# EAGLE design comms_sys_schematic_R2 (EAGLE 9.5.2)
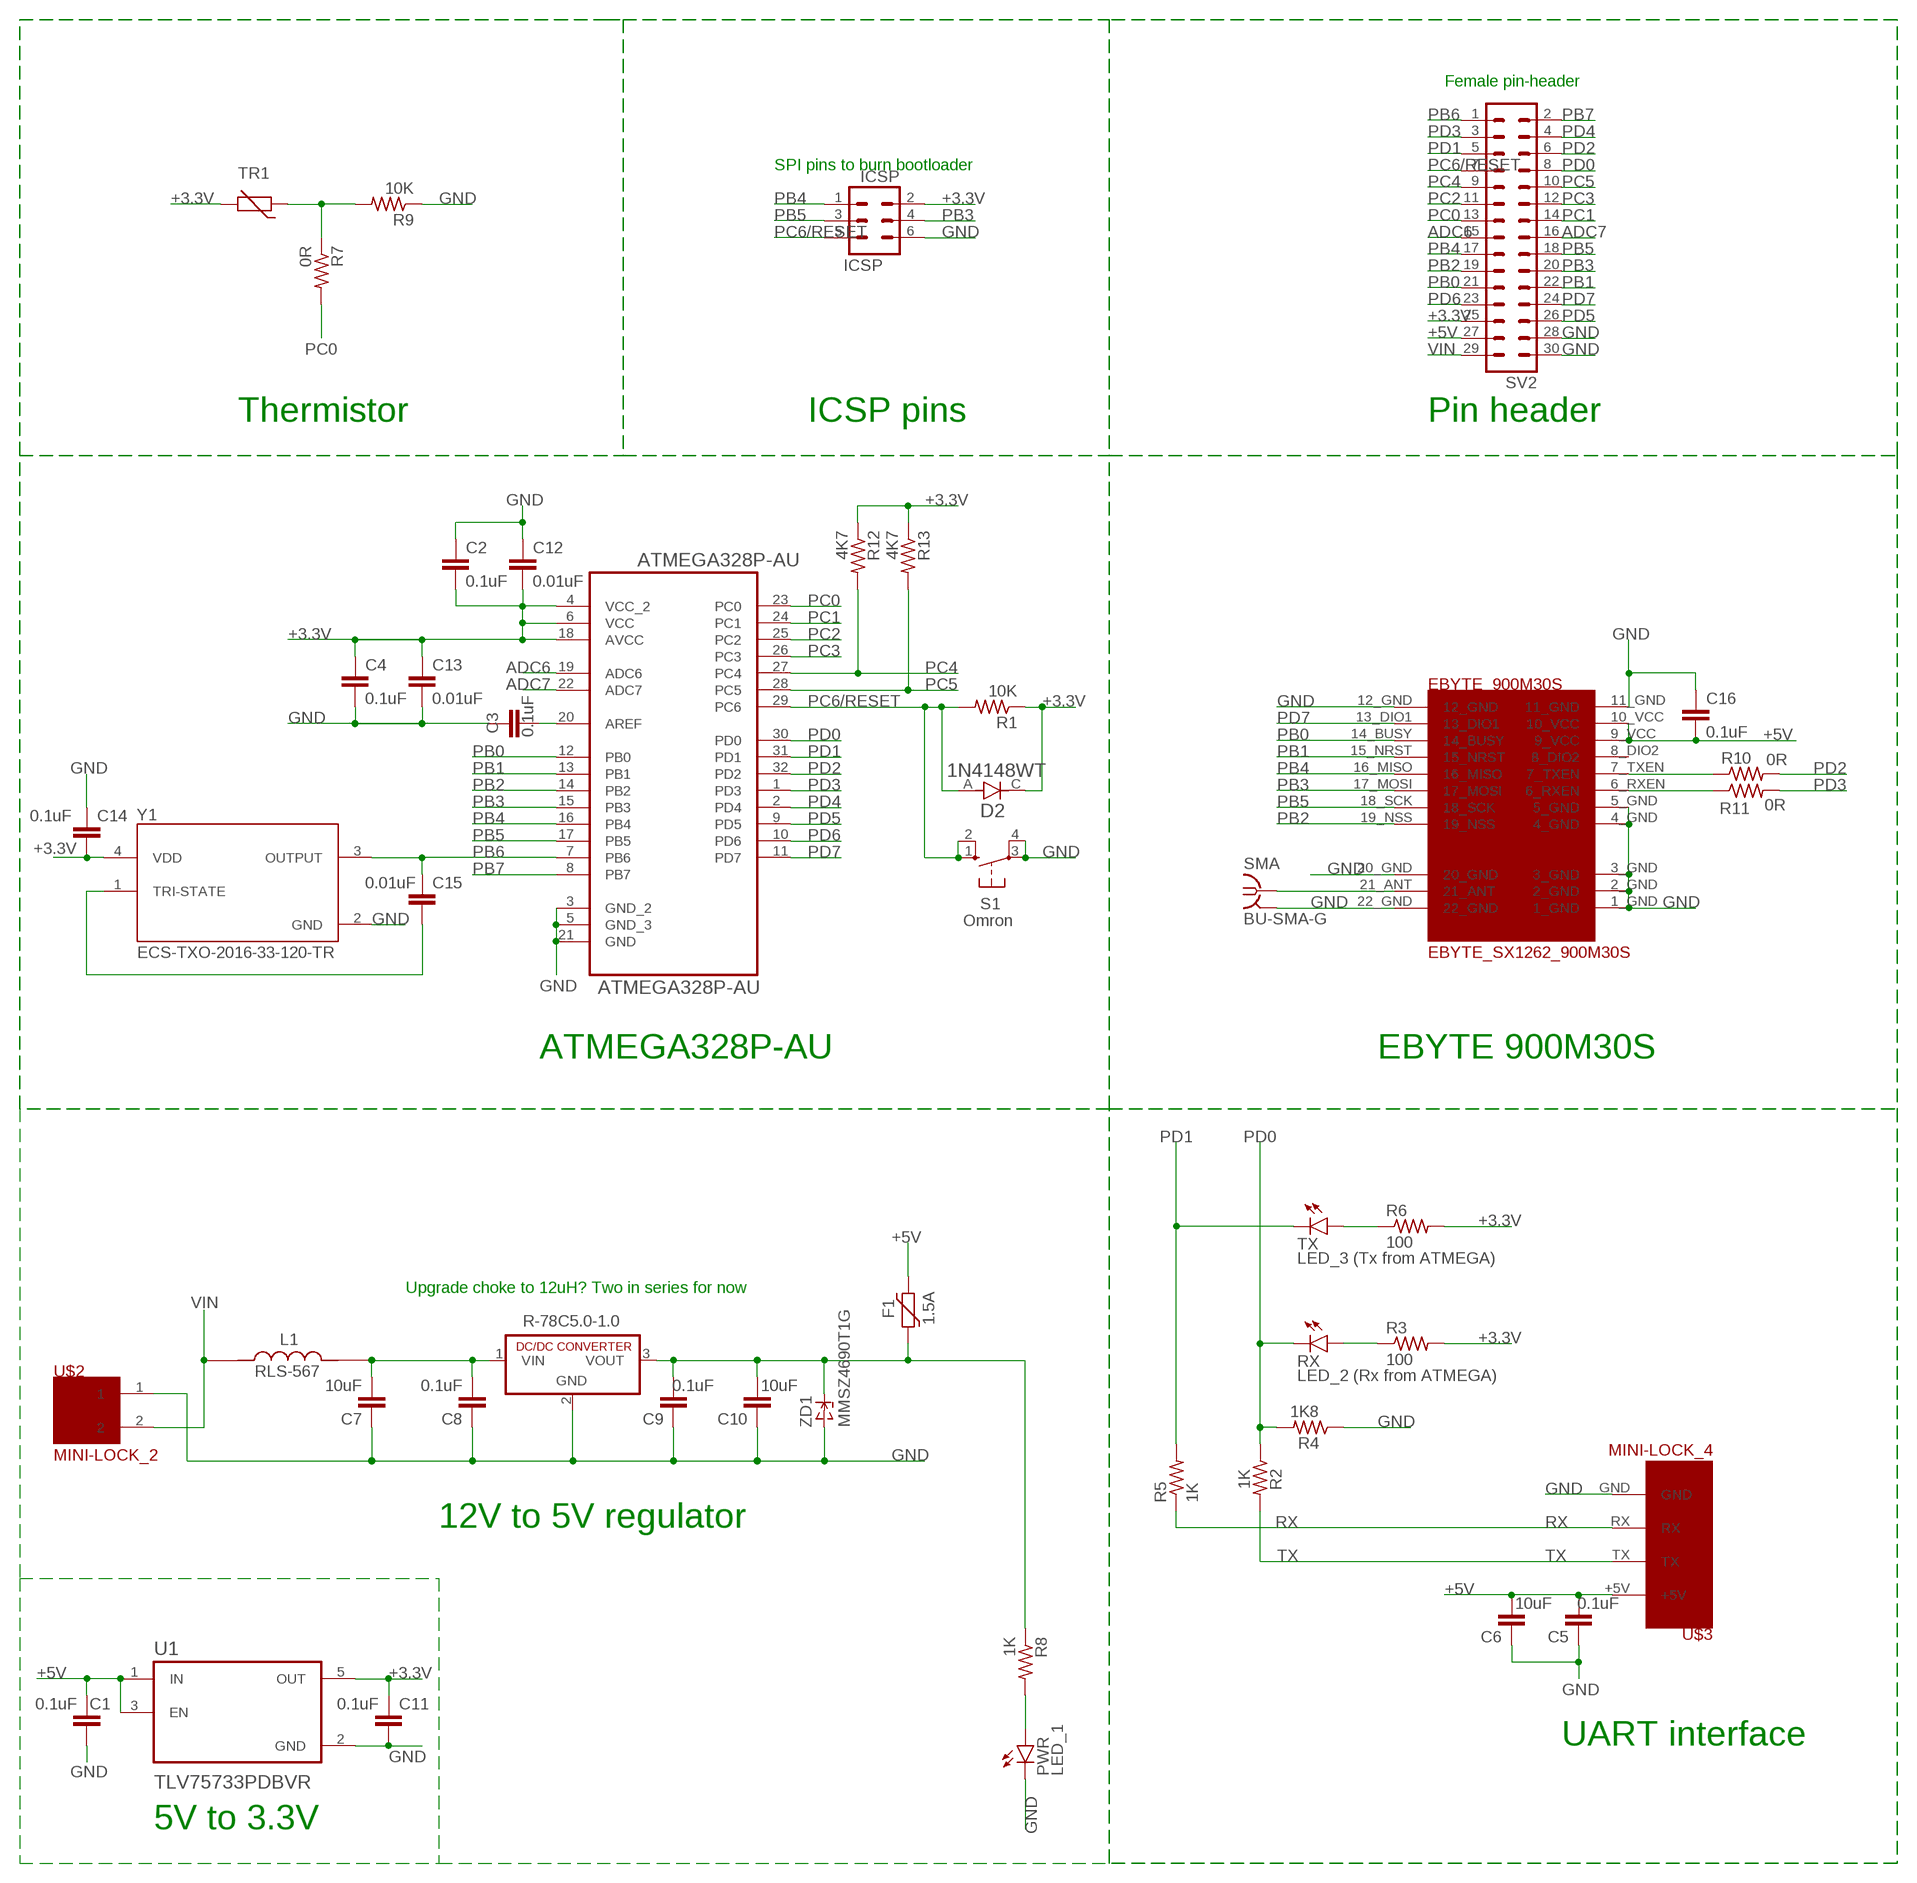
[diagram p0: schematic, sheet 1]

## Parts
ATMEGA328P-AU  ATMEGA328P-AU  [QFP80P900X900X120-32N]
C1  0.1uF  C-EUC0805  [C0805]
C2  0.1uF  C-EUC0805  [C0805]
C3  0.1uF  C-EUC0805  [C0805]
C4  0.1uF  C-EUC0805  [C0805]
C5  0.1uF  C-EUC0805  [C0805]
C6  10uF  C-EUC0805  [C0805]
C7  10uF  C-EUC0805  [C0805]
C8  0.1uF  C-EUC0805  [C0805]
C9  0.1uF  C-EUC0805  [C0805]
C10  10uF  C-EUC0805  [C0805]
C11  0.1uF  C-EUC0805  [C0805]
C12  0.01uF  C-EUC0805  [C0805]
C13  0.01uF  C-EUC0805  [C0805]
C14  0.1uF  C-EUC0805  [C0805]
C15  0.01uF  C-EUC0805  [C0805]
C16  0.1uF  C-EUC0805  [C0805]
D2  1N4148WT  [SODFL1608X70N]
EBYTE_900M30S  EBYTE_SX1262_900M30S  [EBYTE_SX1262_900M30S_FOOTPRINT]
F1  1.5A  FUSE_PTC-0805  [PTC0805]
ICSP  ICSP  MA03-2  [MA03-2]
L1  RLS-567  [IND_RLS-567]
PWR  LED_1  LEDCHIP-LED0805  [CHIP-LED0805]
R1  10K  R-US_R0805  [R0805]
R2  1K  R-US_R0805  [R0805]
R3  100  R-US_R0805  [R0805]
R4  1K8  R-US_R0805  [R0805]
R5  1K  R-US_R0805  [R0805]
R6  100  R-US_R0805  [R0805]
R7  0R  R-US_R0805  [R0805]
R8  1K  R-US_R0805  [R0805]
R9  10K  R-US_R0805  [R0805]
R10  0R  R-US_R0805  [R0805]
R11  0R  R-US_R0805  [R0805]
R12  4K7  R-US_R0805  [R0805]
R13  4K7  R-US_R0805  [R0805]
R-78C5.0-1.0  R-78C5.0-1.0  [SIP3]
RX  LED_2 (Rx from ATMEGA)  LEDCHIP-LED0805  [CHIP-LED0805]
S1  Omron  10-XX  [B3F-10XX]
SMA  BU-SMA-G  [BU-SMA-G]
SV2  MA15-2  [MA15-2]
TR1  THERMISTOR_R-2,5  [RS-2,5]
TX  LED_3 (Tx from ATMEGA)  LEDCHIP-LED0805  [CHIP-LED0805]
U1  TLV75733PDBVR  [SOT95P280X145-5N]
U$2  MINI-LOCK_2  [MINI-LOCK_2]
U$3  MINI-LOCK_4  [MINI-LOCK_4]
Y1  ECS-TXO-2016-33-120-TR  [OSC_ECS-TXO-2016-33-120-TR]
ZD1  MMSZ4690T1G  ZENERSOD-123  [SOD-123]

## Nets
$N77: R7.1 R9.2 TR1.1
+3.3V: ATMEGA328P-AU.4(VCC_2) ATMEGA328P-AU.6(VCC) ATMEGA328P-AU.18(AVCC) C2.2 C4.1 C11.2 C12.2 C13.1 C14.2 D2.C ICSP.2 R1.1 R3.2 R6.2 R12.1 R13.1 SV2.25 TR1.2 U1.5(OUT) Y1.4(VDD)
+5V: C1.2 C5.2 C6.2 C16.2 EBYTE_900M30S.9_VCC EBYTE_900M30S.10_VCC F1.2 SV2.27 U1.1(IN) U1.3(EN) U$3.+5V
ADC6: ATMEGA328P-AU.19(ADC6) SV2.15
ADC7: ATMEGA328P-AU.22(ADC7) SV2.16
GND: ATMEGA328P-AU.3(GND_2) ATMEGA328P-AU.5(GND_3) ATMEGA328P-AU.21(GND) C1.1 C2.1 C3.1 C4.2 C5.1 C6.1 C7.1 C8.1 C9.1 C10.1 C11.1 C12.1 C13.2 C14.1 C16.1 EBYTE_900M30S.1_GND EBYTE_900M30S.2_GND EBYTE_900M30S.3_GND EBYTE_900M30S.4_GND EBYTE_900M30S.5_GND EBYTE_900M30S.11_GND EBYTE_900M30S.12_GND EBYTE_900M30S.20_GND EBYTE_900M30S.22_GND ICSP.6 PWR.C R4.1 R9.1 R-78C5.0-1.0.2(GND) S1.3(P) S1.4(P1) SMA.2 SMA.3 SMA.4 SMA.5 SV2.28 SV2.30 U1.2(GND) U$2.1 U$3.GND Y1.2(GND) ZD1.A
N$1: C9.2 C10.2 F1.1 R8.1 R-78C5.0-1.0.3(VOUT) ZD1.C
N$4: PWR.A R8.2
N$5: C15.2 Y1.1(TRI-STATE)
N$6: EBYTE_900M30S.7_TXEN R10.1
N$7: EBYTE_900M30S.6_RXEN R11.1
N$8: EBYTE_900M30S.21_ANT SMA.1
N$12: R3.1 RX.A
N$14: ATMEGA328P-AU.20(AREF) C3.2
N$16: R6.1 TX.A
N$27: C7.2 C8.2 L1.2 R-78C5.0-1.0.1(VIN)
PB0: ATMEGA328P-AU.12(PB0) EBYTE_900M30S.14_BUSY SV2.21
PB1: ATMEGA328P-AU.13(PB1) EBYTE_900M30S.15_NRST SV2.22
PB2: ATMEGA328P-AU.14(PB2) EBYTE_900M30S.19_NSS SV2.19
PB3: ATMEGA328P-AU.15(PB3) EBYTE_900M30S.17_MOSI ICSP.4 SV2.20
PB4: ATMEGA328P-AU.16(PB4) EBYTE_900M30S.16_MISO ICSP.1 SV2.17
PB5 [SCK]: ATMEGA328P-AU.17(PB5) EBYTE_900M30S.18_SCK ICSP.3 SV2.18
PB6: ATMEGA328P-AU.7(PB6) C15.1 SV2.1 Y1.3(OUTPUT)
PB7: ATMEGA328P-AU.8(PB7) SV2.2
PC0: ATMEGA328P-AU.23(PC0) R7.2 SV2.13
PC1: ATMEGA328P-AU.24(PC1) SV2.14
PC2: ATMEGA328P-AU.25(PC2) SV2.11
PC3: ATMEGA328P-AU.26(PC3) SV2.12
PC4: ATMEGA328P-AU.27(PC4) R12.2 SV2.9
PC5: ATMEGA328P-AU.28(PC5) R13.2 SV2.10
PC6/RESET: ATMEGA328P-AU.29(PC6) D2.A ICSP.5 R1.2 S1.1(S) S1.2(S1) SV2.7
PD0: ATMEGA328P-AU.30(PD0) R2.1 R4.2 RX.C SV2.8
PD1: ATMEGA328P-AU.31(PD1) R5.2 SV2.5 TX.C
PD2: ATMEGA328P-AU.32(PD2) R10.2 SV2.6
PD3: ATMEGA328P-AU.1(PD3) R11.2 SV2.3
PD4: ATMEGA328P-AU.2(PD4) SV2.4
PD5: ATMEGA328P-AU.9(PD5) SV2.26
PD6: ATMEGA328P-AU.10(PD6) SV2.23
PD7: ATMEGA328P-AU.11(PD7) EBYTE_900M30S.13_DIO1 SV2.24
RX: R5.1 U$3.RX
TX: R2.2 U$3.TX
VIN: L1.1 SV2.29 U$2.2
Unconnected: EBYTE_900M30S.8_DIO2

## Notes on the sheet
- Female pin-header
- SPI pins to burn bootloader
- Thermistor | ICSP pins | Pin header
- ATMEGA328P-AU | EBYTE 900M30S
- Upgrade choke to 12uH? Two in series for now
- 12V to 5V regulator
- UART interface
- 5V to 3.3V

## Library data of the parts
ATMEGA328P-AU = Atmel_By_element14_Batch_1-00:ATMEGA328P-AU: 8-bit Microcontroller with In-System Programmable Flash; MPN: ATMEGA328P-AU; OC_FARNELL: 1715486; OC_NEWARK: 14R4631; PACKAGE: TQFP-32; SUPPLIER: Atmel
C1-C16 = rcl:C-EU: CAPACITOR, European symbol; SPICEPREFIX: C
D2 = 1N4148WT:1N4148WT: Diode Switching 100V 0.125A 2-Pin SOD-523; DESCRIPTION: Diode Standard 75V 200mA Surface Mount SOD-523F; DIGI-KEY_PART_NUMBER: 1N4148WTCT-ND; MF: ON Semiconductor; MP: 1N4148WT; PACKAGE: SOD-523-2 ON Semiconductor; PURCHASE-URL: https://pricing.snapeda.com/search/part/1N4148WT/?ref=eda
EBYTE_900M30S = cust_parts:EBYTE_SX1262_900M30S
F1 = dp_devices.v6:FUSE_PTC: Resettable PTC
ICSP = con-lstb:MA03-2: PIN HEADER; OC_FARNELL: unknown; OC_NEWARK: unknown
L1 = RLS-567:RLS-567: Line Inductors for RECOM Power Supply; AVAILABILITY: Unavailable; DESCRIPTION: Line Inductors for RECOM Power Supply; DIGIKEY-PURCHASE-URL: https://snapeda.com/shop?store=DigiKey&id=3641543; MF: Recom Power; MP: RLS-567; PACKAGE: 1812 Recom Power; PRICE: None
PWR RX TX = led:LED: LED OSRAM: - CHIPLED LG R971, LG N971, LY N971, LG Q971, LY Q971, LO R971, LY R971 LH N974, LH R974 LS Q976, LO Q976, LY Q976 LO Q996 - Hyper CHIPLED LW Q18S LB Q993, LB Q99A, LB R99A - SideLED LS A670, LO A670, LY A670, LG A670, LP A670 LB A673, LV A673, LT A673, LW A673 LH A674 LY A675 LS A676, LA A676, LO A676, LY A676, LW A676 LS A679, LY A679, LG A679 - Hyper Micro SIDELED® LS Y876, LA Y876, LO Y876, LY Y876 LT Y87S - SmartLED LW L88C, LW L88S LB L89C, LB L89S, LG L890 LS L89K, LO L89K, LY L89K LS L896, LA L896, LO L896, LY L896 - TOPLED LS T670, LO T670, LY T670, LG T670, LP T670 LSG T670, LSP T670, LSY T670, LOP T670, LYG T670 LG T671, LOG T671, LSG T671 LB T673, LV T673, LT T673, LW T673 LH T674 LS T676, LA T676, LO T676, LY T676, LB T676, LH T676, LSB T676, LW T676 LB T67C, LV T67C, LT T67C, LS T67K, LO T67K, LY T67K, LW E67C LS E67B, LA E67B, LO E67B, LY E67B, LB E67C, LV E67C, LT E67C LW T67C LS T679, LY T679, LG T679 LS T770, LO T770, LY T770, LG T770, LP T770 LB T773, LV T773, LT T773, LW T773 LH T774 LS E675, LA E675, LY E675, LS T675 LS T776, LA T776, LO T776, LY T776, LB T776 LHGB T686 LT T68C, LB T68C - Hyper Mini TOPLED® LB M676 - Mini TOPLED Santana® LG M470 LS M47K, LO M47K, LY M47K Source: http://www.osram.convergy.de LUXEON: - LUMILED® LXK2-PW12-R00, LXK2-PW12-S00, LXK2-PW14-U00, LXK2-PW14-V00 LXK2-PM12-R00, LXK2-PM12-S00, LXK2-PM14-U00 LXK2-PE12-Q00, LXK2-PE12-R00, LXK2-PE12-S00, LXK2-PE14-T00, LXK2-PE14-U00 LXK2-PB12-K00, LXK2-PB12-L00, LXK2-PB12-M00, LXK2-PB14-N00, LXK2-PB14-P00, LXK2-PB14-Q00 LXK2-PR12-L00, LXK2-PR12-M00, LXK2-PR14-Q00, LXK2-PR14-R00 LXK2-PD12-Q00, LXK2-PD12-R00, LXK2-PD12-S00 LXK2-PH12-R00, LXK2-PH12-S00 LXK2-PL12-P00, LXK2-PL12-Q00, LXK2-PL12-R00 Source: www.luxeon.com KINGBRIGHT: KA-3528ASYC Source: www.kingbright.com
R1-R13 = rcl:R-US_: RESISTOR, American symbol; SPICEPREFIX: R
R-78C5.0-1.0 = dc-dc-converter:R-78C*-1.0: INNOLINE DC/DC-Converter 1.0 AMP SIP3 Single Output Source: Data sheet <http://www.mikrocontroller.net/attachment/150645/157764-da-01-en-DC_DC_WANDLER_R_78C5_0_1_0.pdf>
S1 = switch-omron:10-XX: OMRON SWITCH; MPN: B3F-1000; OC_FARNELL: 176432; OC_NEWARK: 36M3542
SMA = con-coax:BU-SMA-G: FEMALE SMA CONNECTOR Radiall distributor RS 193-9117; OC_FARNELL: unknown; OC_NEWARK: unknown
SV2 = con-lstb:MA15-2: PIN HEADER
TR1 = discrete:THERMISTOR_: Thermo Resistor
U1 = TLV75733PDBVR:TLV75733PDBVR; DESCRIPTION: 1-A, low-IQ, high-accuracy, low-dropout voltage regulator with enable 5-SOT-23 -40 to 125; DIGI-KEY_PART_NUMBER: 296-50414-1-ND; MF: Texas Instruments; MP: TLV75733PDBVR; PACKAGE: SOT-23-5 Texas Instruments; PURCHASE-URL: https://pricing.snapeda.com/search/part/TLV75733PDBVR/?ref=eda
U$2 = cust_parts:MINI-LOCK_2
U$3 = cust_parts:MINI-LOCK_4
Y1 = ECS-TXO-2016-33-120-TR:ECS-TXO-2016-33-120-TR; DESCRIPTION: Oscillator TCXO 12MHz ±2ppm (Tol) ±2.5ppm (Stability) 15pF HCMOS 55% 3.3V 4-Pin Mini-CSMD T/R; DIGI-KEY_PART_NUMBER: XC3160CT-ND; MF: ECS Inc.; MP: ECS-TXO-2016-33-120-TR; PACKAGE: None; PURCHASE-URL: https://pricing.snapeda.com/search/part/ECS-TXO-2016-33-120-TR/?ref=eda
ZD1 = dp_devices.v6:ZENER: Zener Diode SOD-323

## Board
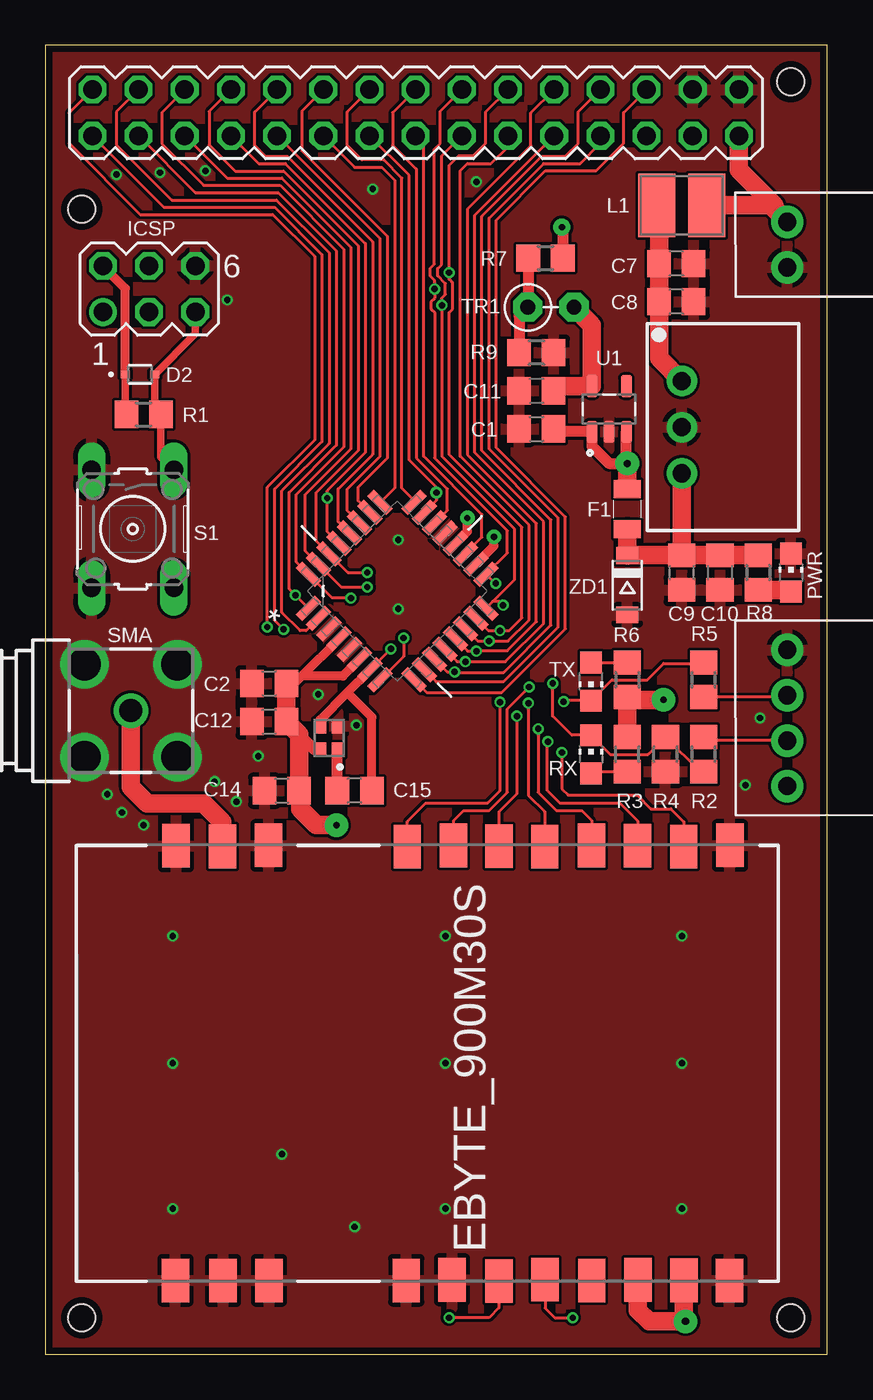
[diagram p1: board, top side]
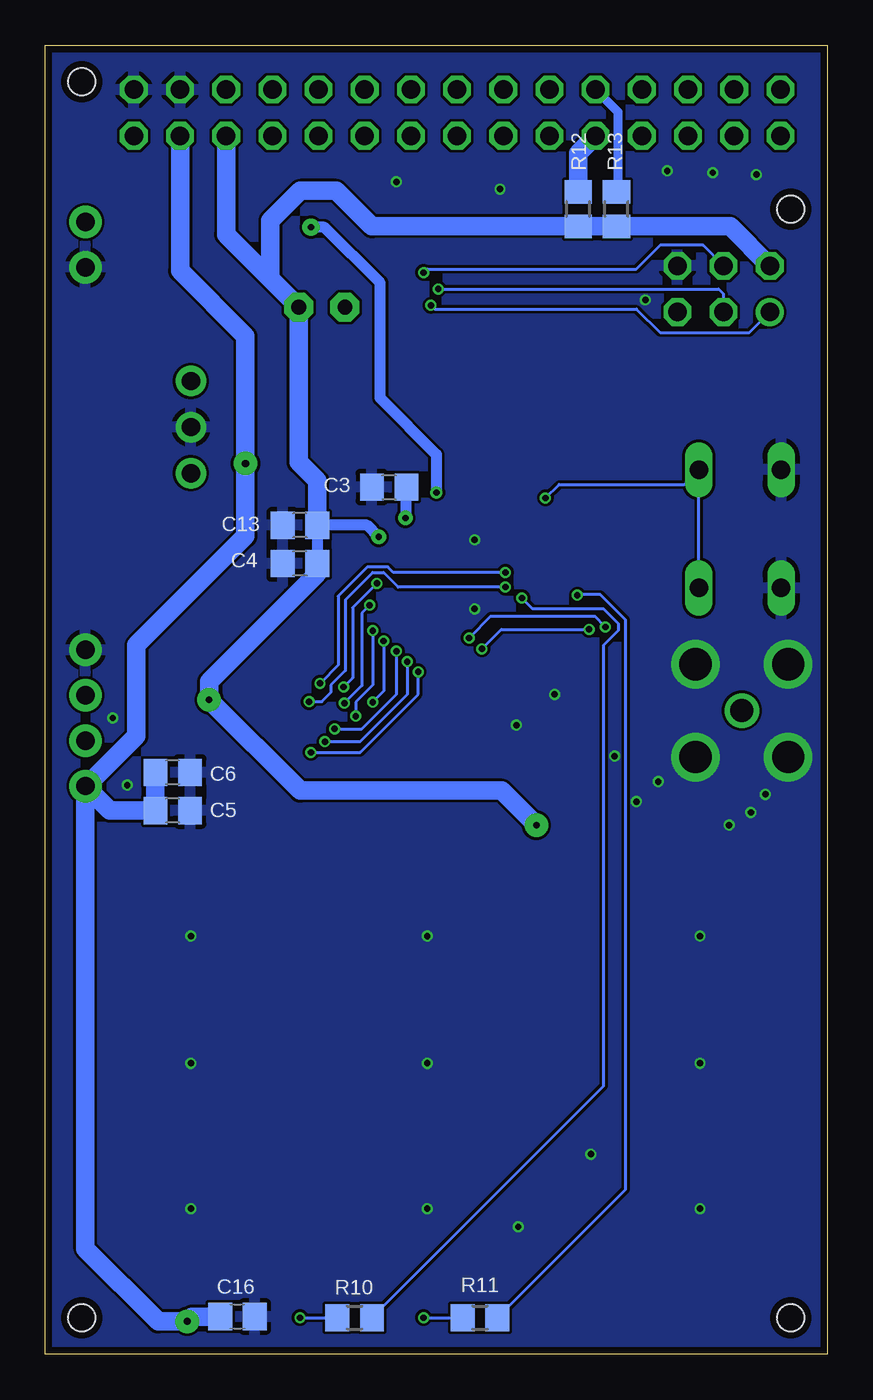
[diagram p2: board, bottom side, seen from below]

Size 43 x 72 mm. Coordinates in mm from the lower left corner, seen from the top.
Outline: 0,0 43,0 43,72 0,72 0,0
Copper layers (1*16): Top 0.035559375mm / dielectric 1.6mm / Bottom 0.035559375mm
Design rules "oshpark-2layer *": minimum track width 6mil, minimum drill 10mil, track to track 6mil, track to pad 6mil, pad to pad 6mil, via to via 6mil, smd to smd 6mil, copper to edge 15mil, drill to drill 6mil, minimum pad ring 5mil, minimum via ring 5mil, stop-mask expansion 2.5mil, vias tented up to drill 0mil, thermal gap 10mil
Holes 1.5 mm at 41,2 2,2 2,63 41,70

### Footprints (pad centres in the part's own frame; a part is rotated, then mirrored left to right if it is on the bottom)
QFP80P900X900X120-32N = smd 1.473 x 0.508: 1 -4.115,2.794; 2 -4.115,2.007; 3 -4.115,1.194; 4 -4.115,0.406; 5 -4.115,-0.406; 6 -4.115,-1.194; 7 -4.115,-2.007; 8 -4.115,-2.794; 17 4.115,-2.794; 18 4.115,-2.007; 19 4.115,-1.194; 20 4.115,-0.406; 21 4.115,0.406; 22 4.115,1.194; 23 4.115,2.007; 24 4.115,2.794 | smd 0.508 x 1.473: 9 -2.794,-4.115; 10 -2.007,-4.115; 11 -1.194,-4.115; 12 -0.406,-4.115; 13 0.406,-4.115; 14 1.194,-4.115; 15 2.007,-4.115; 16 2.794,-4.115; 25 2.794,4.115; 26 2.007,4.115; 27 1.194,4.115; 28 0.406,4.115; 29 -0.406,4.115; 30 -1.194,4.115; 31 -2.007,4.115; 32 -2.794,4.115
C0805 = smd 1.3 x 1.5: 1 -0.95,0; 2 0.95,0
SODFL1608X70N = smd 0.53 x 0.4: A 0.8,0; C -0.8,0
EBYTE_SX1262_900M30S_FOOTPRINT = smd 2.4 x 1.5: 1_GND 11.946,-13.848; 2_GND 11.953,-11.232; 3_GND 11.946,-8.7; 4_GND 11.946,-1.155; 5_GND 11.915,1.361; 6_RXEN 11.984,3.939; 7_TXEN 11.907,6.479; 8_DIO2 11.953,9.049; 9_VCC 11.915,11.589; 10_VCC 11.938,14.113; 11_GND 11.946,16.622; 12_GND -11.991,16.645; 13_DIO1 -11.917,14.112; 14_BUSY -11.965,11.563; 15_NRST -11.986,9.038; 16_MISO -11.914,6.456; 17_MOSI -11.937,3.938; 18_SCK -11.986,1.435; 19_NSS -11.907,-1.1; 20_GND -11.992,-8.731; 21_ANT -11.93,-11.263; 22_GND -11.961,-13.818
PTC0805 = smd 1 x 1.5: 1 -1.1,0; 2 1.1,0
MA03-2 = drill 1.016: 1 -2.54,-1.27 | drill 1.016 octagon: 2 -2.54,1.27; 3 0,-1.27; 4 0,1.27; 5 2.54,-1.27; 6 2.54,1.27
IND_RLS-567 = smd 2.05 x 3.5: 1 -1.375,0; 2 1.375,0
CHIP-LED0805 = smd 1.2 x 1.2: A 0,-1.05; C 0,1.05
R0805 = smd 1.3 x 1.5: 1 -0.95,0; 2 0.95,0
SIP3 = drill 1 pad 1.676: 1 -2.54,0; 2 0,0; 3 2.54,0
B3F-10XX = drill 1.016 long: 1 -3.251,2.261; 2 3.251,2.261; 3 -3.251,-2.261; 4 3.251,-2.261
BU-SMA-G = drill 1.27: 1 0,0 | drill 1.778: 2 -2.55,2.55; 3 2.55,2.55; 4 2.55,-2.55; 5 -2.55,-2.55
MA15-2 = drill 1.016 octagon: 1 -20.32,-1.27; 2 -20.32,1.27; 3 -17.78,-1.27; 4 -17.78,1.27; 5 -15.24,-1.27; 6 -15.24,1.27; 7 -12.7,-1.27; 8 -12.7,1.27; 9 -10.16,-1.27; 10 -10.16,1.27; 11 -7.62,-1.27; 12 -7.62,1.27; 13 -5.08,-1.27; 14 -5.08,1.27; 15 -2.54,-1.27; 16 -2.54,1.27; 17 0,-1.27; 18 0,1.27; 19 2.54,-1.27; 20 2.54,1.27; 21 5.08,-1.27; 22 5.08,1.27; 23 7.62,-1.27; 24 7.62,1.27; 25 10.16,-1.27; 26 10.16,1.27; 27 12.7,-1.27; 28 12.7,1.27; 29 15.24,-1.27; 30 15.24,1.27
RS-2,5 = drill 0.813 pad 1.6 octagon: 1 -1.27,0; 2 1.27,0
SOT95P280X145-5N = smd 1.21 x 0.59: 1 -1.255,0.95; 2 -1.255,0; 3 -1.255,-0.95; 4 1.255,-0.95; 5 1.255,0.95
MINI-LOCK_2 = drill 1 pad 1.778: 1 0,1.21; 2 0,-1.29
MINI-LOCK_4 = drill 1 pad 1.778: +5V 0,3.75; GND 0,-3.75; RX 0,-1.25; TX 0,1.25
OSC_ECS-TXO-2016-33-120-TR = smd 0.8 x 0.7: 1 -0.65,-0.5; 2 0.65,-0.5; 3 0.65,0.5; 4 -0.65,0.5
SOD-123 = smd 0.91 x 1.22: A 1.635,0; C -1.635,0

### Placement (x,y rotation side)
ATMEGA328P-AU  19.34,41.98 45 top
C1  27,50.9 0 top
C2  12.3,36.9 0 top
C3  24.1,47.7 0 bottom
C4  29,43.5 180 bottom
C5  36,29.9 180 bottom
C6  36,32 180 bottom
C7  34.7,60 180 top
C8  34.7,57.9 180 top
C9  35,43 90 top
C10  37.1,43 90 top
C11  27,53 0 top
C12  12.3,34.8 0 top
C13  29,45.6 180 bottom
C14  13,31 0 top
C15  17,31 180 top
C16  32.44,2.06 180 bottom
D2  5.2,53.9 0 top
EBYTE_900M30S  21,16 270 top
F1  32,46.5 90 top
ICSP  5.7,58.6 0 top
L1  35,63.2 180 top
PWR  41,43 0 top
R1  5.4,51.7 0 top
R2  36.2,33 90 top
R3  32,33 90 top
R4  34.1,33 90 top
R5  36.2,37.1 90 top
R6  32,37.1 270 top
R7  27.5,60.3 0 top
R8  39.2,43 270 top
R9  27,55.1 180 top
R10  26,2 0 bottom
R11  19.1,2 0 bottom
R12  13.7,63 90 bottom
R13  11.6,63 90 bottom
R-78C5.0-1.0  35,51 270 top
RX  30,33 0 top
S1  4.8,45.4 270 top
SMA  4.7,35.4 180 top
SV2  22.9,68.3 0 top
TR1  27.8,57.6 0 top
TX  30,37 180 top
U1  31,52 90 top
U$2  40.8,61 180 top
U$3  40.8,35 180 top
Y1  15.6,33.9 90 top
ZD1  32,42.3 270 top

### Tracks (layer width: path | path; a pad name or v marks a point on that pad's centre or on a via)
$N77
  Top 0.61: R9.2 26.05,57.12 TR1.1 26.55,57.62 R7.1
+3.3V  (via drill 0.35 pad 0.8, 0.35 pad 1.3)
  Top 0.152: 32,36 R6.2
  Top 0.406: D2.C 4.4,51.75 R1.1
  Top 0.508: ATMEGA328P-AU.18 24.67,44.46 v24.67,44.96 | ICSP.2 4.4,58.63 D2.C | ATMEGA328P-AU.4 14.09,37.3 | 14.09,37.3 13.69,36.9 C2.2 | ATMEGA328P-AU.6 16.36,37.3 14.09,37.3
  Top 0.61: Y1.4 14.8,33.25 13.95,34.1
  Top 1.016: v34,36 32,36 | R6.2 R3.2 | v16,29.1 14.9,29.1 14,30 14,30.95 C14.2 13.95,34.1 C12.2 C2.2 | TR1.2 30.05,56.62 U1.5 28.2,53.26 C11.2
  Bottom 0.61: v24.67,44.96 25.31,45.6 C13.1 C4.1
  Bottom 1.016: C13.1 28.05,48.05 29.07,49.07 TR1.2 30.64,59.16 | C4.1 28.05,42.95 34,37 v34,36 29,31 17.9,31 v16,29.1 | 30.64,59.16 33.06,61.59 SV2.25 | ICSP.2 5.34,62.05 R13.1 R12.1 25.05,62.05 27,64 29,64 30.64,62.37 30.64,59.16
+5V  (via drill 0.4 pad 1.3)
  Top 0.61: U1.3 31.95,49.05 v32,49 31,49 30.05,49.95 U1.1 28.11,50.74 C1.2
  Top 1.016: F1.2 v32,49 | EBYTE_900M30S.10_VCC 35.11,1.89 v35.2,1.8 33.2,1.8 32.59,2.41 EBYTE_900M30S.9_VCC
  Bottom 1.016: C16.2 34.94,2.06 v35.2,1.8 36.8,1.8 40.8,5.8 U$3.+5V | SV2.27 35.6,59.6 32,56 v32,49 32,45 38,39 38,34 40.75,31.25 U$3.+5V | C6.2 C5.2 39.45,29.9 U$3.+5V
ADC6
  Top 0.152: ATMEGA328P-AU.19 24,44.94 24,46.2 20.8,49.4 20.8,66.49 20.36,66.93 SV2.15
ADC7
  Top 0.152: ATMEGA328P-AU.22 22.1,46.42 22.1,47.6 20.4,49.3 20.4,65.2 19.1,66.5 19.1,68.31 SV2.16
GND  (via drill 0.35)
  other vias: 19.4,44.8 19.4,41 17.1,34.6 39.3,35 10,58 11.7,32.9 7,23 35,23 35,8 7,8 22,8 22,23 22,16 35,16 7,16 13,11 17,7 5.4,29.1 4.2,29.8 3.4,30.8 9.3,31.5 10.5,30.4 18,64.1 23.7,64.5 3.9,64.9 6.3,65 8.8,65.1 15,36.3 38.5,31.3
  pour Top: -10,78 54,78 58,74 58,1 48,-9 -6,-9 -11,-4 -11,77
  pour Bottom: -13,81 52,81 61,72 61,1 47,-13 -9,-13 -10,-12 -13,-9
  pour Top (no thermals): 1,40 9,40 10,39 10,31 2,31 1,31 0,32 0,33 0,39
  pour Bottom (no thermals): 1,40 8,40 10,38 10,32 9,31 1,31 0,32 0,39
N$1
  Top 1.016: R-78C5.0-1.0.3 C9.2 | C9.2 C10.2 R8.1 | C9.2 32.02,43.95 ZD1.C F1.1
N$4
  Top 0.508: PWR.A 40.9,42.05
  Top 1.016: 40.9,42.05 R8.2
N$5
  Top 0.508: 16.05,33.2 Y1.1
  Top 0.61: C15.2 16.05,33.2
N$6  (via drill 0.35)
  Top 0.152: EBYTE_900M30S.7_TXEN 27.48,2.52 28,2 v29,2
  Bottom 0.152: v29,2 R10.1
N$7  (via drill 0.35)
  Top 0.152: EBYTE_900M30S.6_RXEN 24.94,2.54 24.4,2 v22.2,2
  Bottom 0.152: v22.2,2 R11.1
N$8
  Top 1.016: EBYTE_900M30S.21_ANT 9.74,29.26 8.7,30.3 5.6,30.3 4.7,31.2 SMA.1
N$12
  Top 0.152: RX.A 30.1,32.05 R3.1
N$14  (via drill 0.35 pad 0.8)
  Top 0.508: ATMEGA328P-AU.20 23.2,45.26 v23.2,46
  Bottom 0.61: v23.2,46 23.15,46.05 C3.2
N$16
  Top 0.152: TX.A R6.1
N$27
  Top 1.016: L1.2 33.75,63.08 C7.2 C8.2 33.75,54.79 R-78C5.0-1.0.1
PB0  (via drill 0.35)
  Top 0.152: ATMEGA328P-AU.12 22.64,38.1 v23.1,38.1 25.3,38.1 27.4,40.2 27.4,45.8 23.6,49.6 23.6,62.65 SV2.21 | v27.63,33.7 27.6,33.7 27.6,31 28.3,30.3 31.6,30.3 32.56,29.34 EBYTE_900M30S.14_BUSY
  Bottom 0.152: v27.63,33.7 25.7,33.7 23.1,36.3 v23.1,38.1
PB1  (via drill 0.35)
  Top 0.152: v27.1,34.4 27.1,30.9 28.1,29.9 29.5,29.9 30.04,29.36 EBYTE_900M30S.15_NRST | ATMEGA328P-AU.13 23.23,38.67 v23.7,38.67 23.73,38.7 25.4,38.7 27,40.3 27,45.7 23.2,49.5 23.2,62.99 26.7,66.49 26.7,68.29 SV2.22
  Bottom 0.152: v27.1,34.4 25.6,34.4 23.7,36.3 v23.7,38.67
PB2  (via drill 0.35)
  Top 0.152: EBYTE_900M30S.19_NSS 19.9,29.3 20.9,30.3 24.3,30.3 25,31 v25,35.87 | ATMEGA328P-AU.14 23.78,39.23 v24.4,39.23 25.43,39.23 26.6,40.4 26.6,45.6 22.8,49.4 22.8,65.1 23.2,65.5 24.5,65.5 25.44,66.44 SV2.19
  Bottom 0.152: v24.4,39.23 24.4,36.47 v25,35.87
PB3  (via drill 0.35)
  Top 0.152: ATMEGA328P-AU.15 24.36,39.8 v25,39.8 25.5,39.8 26.2,40.5 26.2,45.5 22.2,49.5 22.2,57.3 22.4,57.5 22.4,58.93 22.2,59.13 v22.2,59.5 22.2,65.4 22.7,65.9 23.5,65.9 24.2,66.6 24.2,68.33 SV2.20 | v25.93,35.1 v25.94,35.09 25.94,30.84 24.94,29.84 EBYTE_900M30S.17_MOSI
  Bottom 0.152: v25.93,35.1 25.93,35.87 25,36.8 v25,39.8 | ICSP.4 6.83,61 9.2,61 10.5,59.7 22,59.7 v22.2,59.5
PB4  (via drill 0.35)
  Top 0.152: ATMEGA328P-AU.16 24.59,41.41 | 24.59,41.41 25.8,42.61 25.8,45.4 21.8,49.4 v21.8,57.7 21.8,58.1 22,58.3 22,58.9 21.57,59.33 21.57,59.72 21.8,59.95 21.8,65.92 SV2.17 | v25.17,41.2 24.96,41.41 24.59,41.41 | v26.56,35.81 26.56,30.74 27.46,29.84 EBYTE_900M30S.16_MISO
  Bottom 0.152: v25.17,41.2 25.6,40.77 25.6,36.77 v26.56,35.81 | ICSP.1 4.29,56.2 9.2,56.2 10.49,57.49 21.59,57.49 v21.8,57.7
PB5  (via drill 0.35)
  Top 0.152: v26.6,36.7 25.4,35.5 25.4,30.9 24.4,29.9 23,29.9 22.43,29.34 EBYTE_900M30S.18_SCK | v24.77,42.4 24.74,42.4 ATMEGA328P-AU.17 25.4,44.08 25.4,45.3 21.4,49.3 21.4,57.3 21.2,57.5 21.2,57.9 21.4,58.1 v21.4,58.6 21.4,59.07 21.16,59.3 21.16,59.75 21.39,59.97 21.39,66.29 21.7,66.6 21.7,68.37 SV2.18
  Bottom 0.152: v24.77,42.4 26.1,41.07 26.1,37.2 v26.6,36.7 | ICSP.3 5.7,58.33 5.97,58.6 v21.4,58.6
PB6  (via drill 0.35)
  Top 0.152: ATMEGA328P-AU.7 v19,38.79 v19,38.8 | v13.1,39.87 12.6,40.37 12.6,47.6 15.2,50.2 15.2,60.5 12.6,63.1 6.51,63.1 SV2.1
  Top 0.508: ATMEGA328P-AU.7 16.6,36.4 | 16.6,36.4 15.1,34.89 Y1.3 | C15.1 17.95,35.05 16.6,36.4
  Bottom 0.152: v19,38.8 17.93,39.87 v13.1,39.87
PB7  (via drill 0.35)
  Top 0.152: ATMEGA328P-AU.8 19.7,38.38 v19.7,39.4 | v12.2,40 12.2,47.7 14.8,50.3 14.8,60.4 12.5,62.7 5.21,62.7 1.3,66.61 1.3,68.29 SV2.2
  Bottom 0.152: v12.2,40 12.8,40.6 18.5,40.6 v19.7,39.4
PC0  (via drill 0.35 pad 0.65, 0.35 pad 0.95)
  Top 0.152: ATMEGA328P-AU.23 21.5,46.97 v21.5,47.4 21.5,47.7 20,49.2 20,64.85 SV2.13
  Top 0.61: v28.4,62 28.45,61.95 R7.2
  Bottom 0.61: v21.5,47.4 21.5,49.5 24.6,52.6 24.6,58.94 27.66,62 v28.4,62
PC1
  Top 0.152: ATMEGA328P-AU.24 20.28,46.96 19.6,47.64 19.6,64.7 18.6,65.7 17.4,65.7 16.6,66.5 16.6,68.35 SV2.14
PC2
  Top 0.152: ATMEGA328P-AU.25 19.2,47.65 19.2,64.6 18.5,65.3 17.01,65.3 SV2.11
PC3
  Top 0.152: ATMEGA328P-AU.26 17.2,46.96 17.2,47.7 18.81,49.31 18.81,61.5 14.1,66.21 14.1,68.39 SV2.12
PC4
  Top 0.152: SV2.9 18.4,61.37 18.4,49.4 16.6,47.6 16.6,46.41 ATMEGA328P-AU.27
  Bottom 1.016: R12.2 13.7,66.07 SV2.9
PC5
  Top 0.152: SV2.10 11.5,68.33 11.5,66.5 12.1,65.9 13.3,65.9 18,61.2 18,49.5 16.1,47.6 16.1,45.8 ATMEGA328P-AU.28
  Bottom 0.508: SV2.10 11.5,68.33 11.5,64.05 R13.2
PC6/RESET  (via drill 0.35)
  Top 0.152: SV2.7 11.73,65.5 13.2,65.5 17.6,61.1 17.6,49.6 15.5,47.5 v15.5,47.1 15.5,45.24 ATMEGA328P-AU.29
  Top 0.406: ICSP.5 8.24,56.14 D2.A 6,52.05 R1.2 6.35,49.36 S1.1
  Bottom 0.152: v15.5,47.1 14.75,47.85 7.86,47.85 S1.1 S1.2
PD0  (via drill 0.35)
  Top 0.152: v27.9,36.9 27.9,35.1 28.95,34.05 RX.C 31.05,33 33.15,33 R4.2 36,32.05 R2.1 | v17.7,43 16.63,43 ATMEGA328P-AU.30 14.9,44.73 14.9,47.4 17.2,49.7 17.2,60.99 13.1,65.09 10.44,65.09 9,66.53 9,68.37 SV2.8
  Bottom 0.152: v27.9,36.9 26.9,37.9 26.9,41.7 25.3,43.3 24.17,43.3 23.87,43 v17.7,43
PD1  (via drill 0.35)
  Top 0.152: R5.2 36.15,38 34,38 33.1,37.1 31.15,37.1 TX.C 28.55,35.95 v28.5,35.9 | v17.7,42.2 16.28,42.2 ATMEGA328P-AU.31 14.3,44.18 14.3,47.3 16.8,49.8 16.8,60.9 13,64.7 9.99,64.7 SV2.5
  Bottom 0.152: v28.5,35.9 27.8,35.9 27.3,36.4 27.3,36.8 26.5,37.6 26.5,41.5 25,43 24.4,43 23.6,42.2 v17.7,42.2
PD2  (via drill 0.35)
  Top 0.152: v16.8,41.6 15.77,41.6 ATMEGA328P-AU.32 13.8,43.57 13.8,47.3 16.4,49.9 16.4,60.8 12.9,64.3 8.7,64.3 6.4,66.6 6.4,68.31 SV2.6
  Bottom 0.152: v16.8,41.6 16.2,41 12.3,41 11.5,40.2 11.5,39.8 12.3,39 12.3,14.75 R10.2
PD3  (via drill 0.35)
  Top 0.152: ATMEGA328P-AU.1 v13.75,41.75 13.4,42.1 13.4,47.4 16,50 16,60.7 12.8,63.9 8.25,63.9 SV2.3
  Bottom 0.152: v13.75,41.75 13.7,41.8 12.5,41.8 11.1,40.4 11.1,9.05 R11.2
PD4
  Top 0.152: ATMEGA328P-AU.2 14.33,39.8 14,39.8 13,40.8 13,47.5 15.6,50.1 15.6,60.6 12.7,63.5 6.95,63.5 3.9,66.55 3.9,68.35 SV2.4
PD5
  Top 0.152: ATMEGA328P-AU.9 20.97,36.4 25.1,36.4 28.6,39.9 28.6,46.06 24.8,49.86 24.8,62.4 27.5,65.1 30.29,65.1 31.8,66.61 31.8,68.31 SV2.26
PD6
  Top 0.152: ATMEGA328P-AU.10 21.48,37 25.2,37 28.2,40 28.2,46 24.4,49.8 24.4,62.5 27.4,65.5 29.4,65.5 30.52,66.62 SV2.23
PD7  (via drill 0.35)
  Top 0.152: v28.4,33.1 28.4,31.1 28.75,30.75 32.55,30.75 33.3,30 34.4,30 35.11,29.29 EBYTE_900M30S.13_DIO1 | ATMEGA328P-AU.11 22.1,37.53 v22.5,37.53 22.53,37.5 25.2,37.5 27.8,40.1 27.8,45.9 24,49.7 24,62.6 27.3,65.9 28.6,65.9 29.3,66.6 29.3,68.35 SV2.24
  Bottom 0.152: v28.4,33.1 25.7,33.1 22.5,36.3 v22.5,37.53
RX
  Top 0.152: U$3.RX 40.7,36.15 R5.1
TX
  Top 0.152: U$3.TX 36.4,33.75 R2.2
VIN
  Top 1.016: U$2.2 39.89,63.2 | 39.89,63.2 40.09,63.2 38.14,65.15 SV2.29 | 39.89,63.2 L1.1